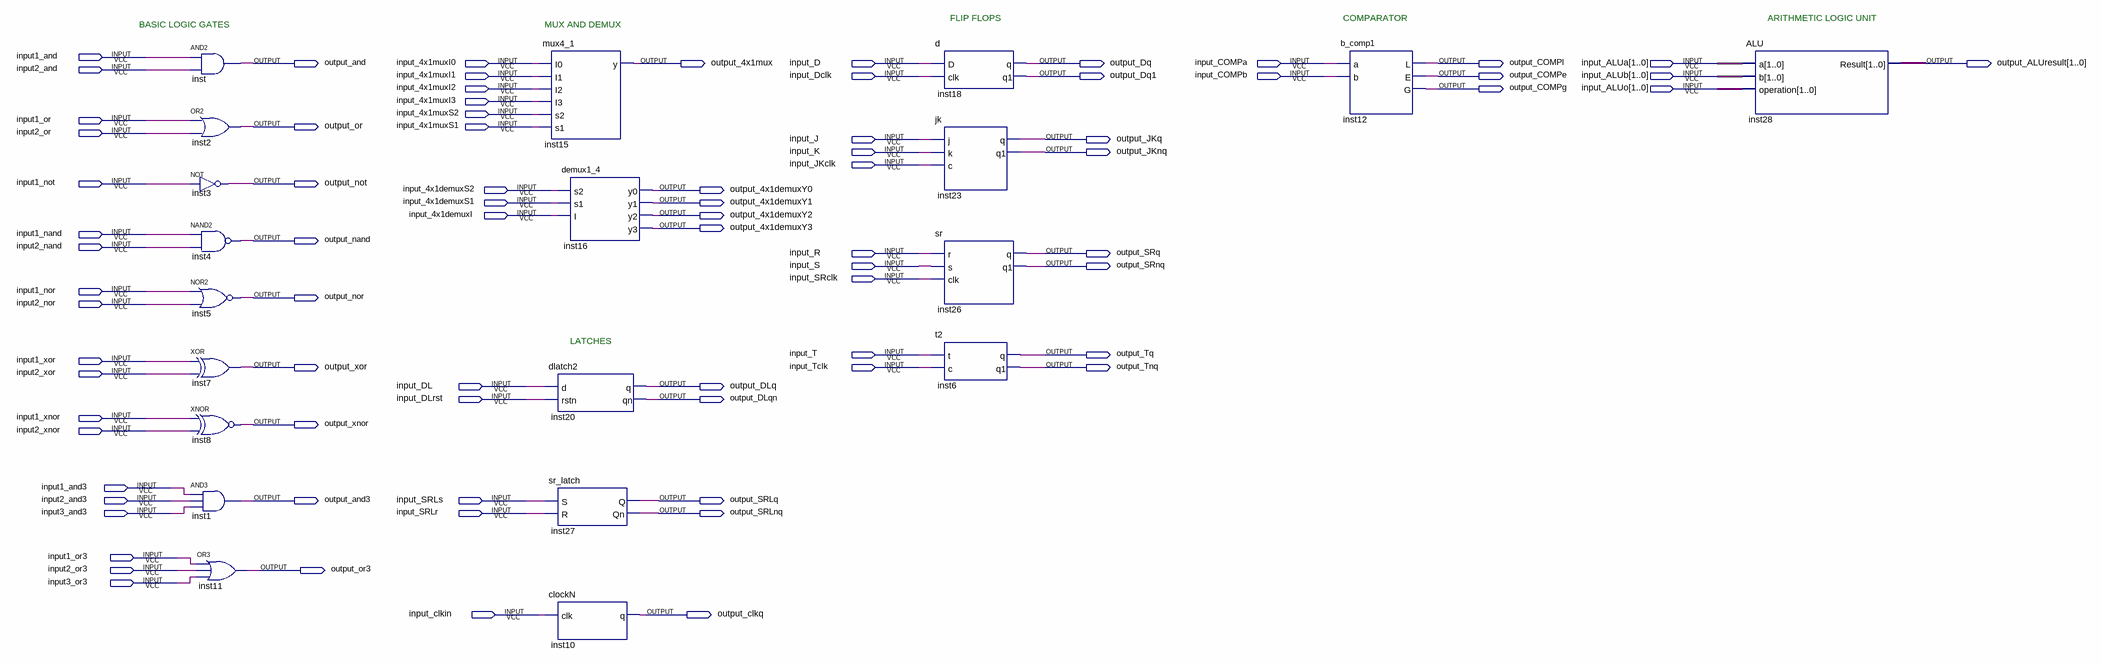
[diagram p0: schematic sheet]
// Quartus schematic TopSchematic.bdf as structural Verilog: 20 symbols, 79 pins
module TopSchematic (
  input  input1_and,
  input  input_4x1muxI0,
  input  input_D,
  input  input_COMPa,
  input  [1:0] input_ALUa,
  input  input2_and,
  input  input_4x1muxI1,
  input  input_Dclk,
  input  input_COMPb,
  input  [1:0] input_ALUb,
  input  input_4x1muxI2,
  input  [1:0] input_ALUo,
  input  input_4x1muxI3,
  input  input_4x1muxS2,
  input  input1_or,
  input  input_4x1muxS1,
  input  input2_or,
  input  input_J,
  input  input_K,
  input  input_JKclk,
  input  input1_not,
  input  input_4x1demuxS2,
  input  input_4x1demuxS1,
  input  input_4x1demuxI,
  input  input1_nand,
  input  input2_nand,
  input  input_R,
  input  input_S,
  input  input_SRclk,
  input  input1_nor,
  input  input2_nor,
  input  input_T,
  input  input1_xor,
  input  input_Tclk,
  input  input2_xor,
  input  input_DL,
  input  input_DLrst,
  input  input1_xnor,
  input  input2_xnor,
  input  input1_and3,
  input  input2_and3,
  input  input_SRLs,
  input  input3_and3,
  input  input_SRLr,
  input  input1_or3,
  input  input2_or3,
  input  input3_or3,
  input  input_clkin,
  output output_and,
  output output_4x1mux,
  output output_Dq,
  output output_COMPl,
  output [1:0] output_ALUresult,
  output output_Dq1,
  output output_COMPe,
  output output_COMPg,
  output output_or,
  output output_JKq,
  output output_JKnq,
  output output_not,
  output output_4x1demuxY0,
  output output_4x1demuxY1,
  output output_4x1demuxY2,
  output output_4x1demuxY3,
  output output_nand,
  output output_SRq,
  output output_SRnq,
  output output_nor,
  output output_Tq,
  output output_xor,
  output output_Tnq,
  output output_DLq,
  output output_DLqn,
  output output_xnor,
  output output_and3,
  output output_SRLq,
  output output_SRLnq,
  output output_or3,
  output output_clkq
);

  and inst (output_and, input1_and, input2_and);
  or inst2 (output_or, input1_or, input2_or);
  not inst3 (output_not, input1_not);
  nand inst4 (output_nand, input1_nand, input2_nand);
  nor inst5 (output_nor, input1_nor, input2_nor);
  xor inst7 (output_xor, input1_xor, input2_xor);
  xnor inst8 (output_xnor, input1_xnor, input2_xnor);
  and inst1 (output_and3, input1_and3, input2_and3, input3_and3);
  or inst11 (output_or3, input1_or3, input2_or3, input3_or3);
  mux4_1 inst15 (
    .I0(input_4x1muxI0), .I1(input_4x1muxI1), .I2(input_4x1muxI2), .I3(input_4x1muxI3), .s2(input_4x1muxS2),
    .s1(input_4x1muxS1), .y(output_4x1mux));
  demux1_4 inst16 (
    .s2(input_4x1demuxS2), .s1(input_4x1demuxS1), .I(input_4x1demuxI), .y0(output_4x1demuxY0),
    .y1(output_4x1demuxY1), .y2(output_4x1demuxY2), .y3(output_4x1demuxY3));
  dlatch2 inst20 (.d(input_DL), .rstn(input_DLrst), .q(output_DLq), .qn(output_DLqn));
  sr_latch inst27 (.S(input_SRLs), .R(input_SRLr), .Q(output_SRLq), .Qn(output_SRLnq));
  clockN inst10 (.clk(input_clkin), .q(output_clkq));
  d inst18 (.D(input_D), .clk(input_Dclk), .q(output_Dq), .q1(output_Dq1));
  jk inst23 (.j(input_J), .k(input_K), .c(input_JKclk), .q(output_JKq), .q1(output_JKnq));
  sr inst26 (.r(input_R), .s(input_S), .clk(input_SRclk), .q(output_SRq), .q1(output_SRnq));
  t2 inst6 (.t(input_T), .c(input_Tclk), .q(output_Tq), .q1(output_Tnq));
  b_comp1 inst12 (.a(input_COMPa), .b(input_COMPb), .L(output_COMPl), .E(output_COMPe), .G(output_COMPg));
  ALU inst28 (.a(input_ALUa), .b(input_ALUb), .operation(input_ALUo), .Result(output_ALUresult));

  // Notes on the sheet:
  //   FLIP FLOPS
  //   COMPARATOR
  //   ARITHMETIC LOGIC UNIT
  //   BASIC LOGIC GATES
  //   MUX AND DEMUX
  //   LATCHES
endmodule
